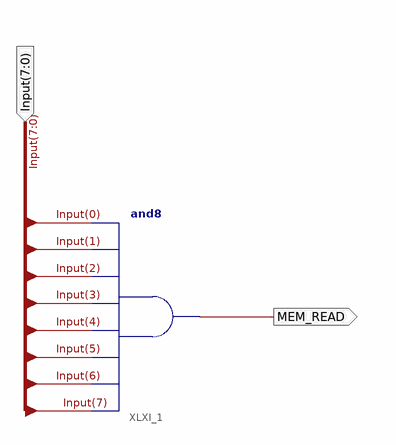
[diagram p0: schematic sheet 1]
// Xilinx ISE schematic mem_read.sch (spartan3e) as structural Verilog: 1 symbols, 2 ports
module mem_read (
  input  [7:0] Input,
  output MEM_READ
);

  and XLXI_1 (MEM_READ, Input[7], Input[6], Input[5], Input[4], Input[3], Input[2], Input[1], Input[0]);
endmodule
